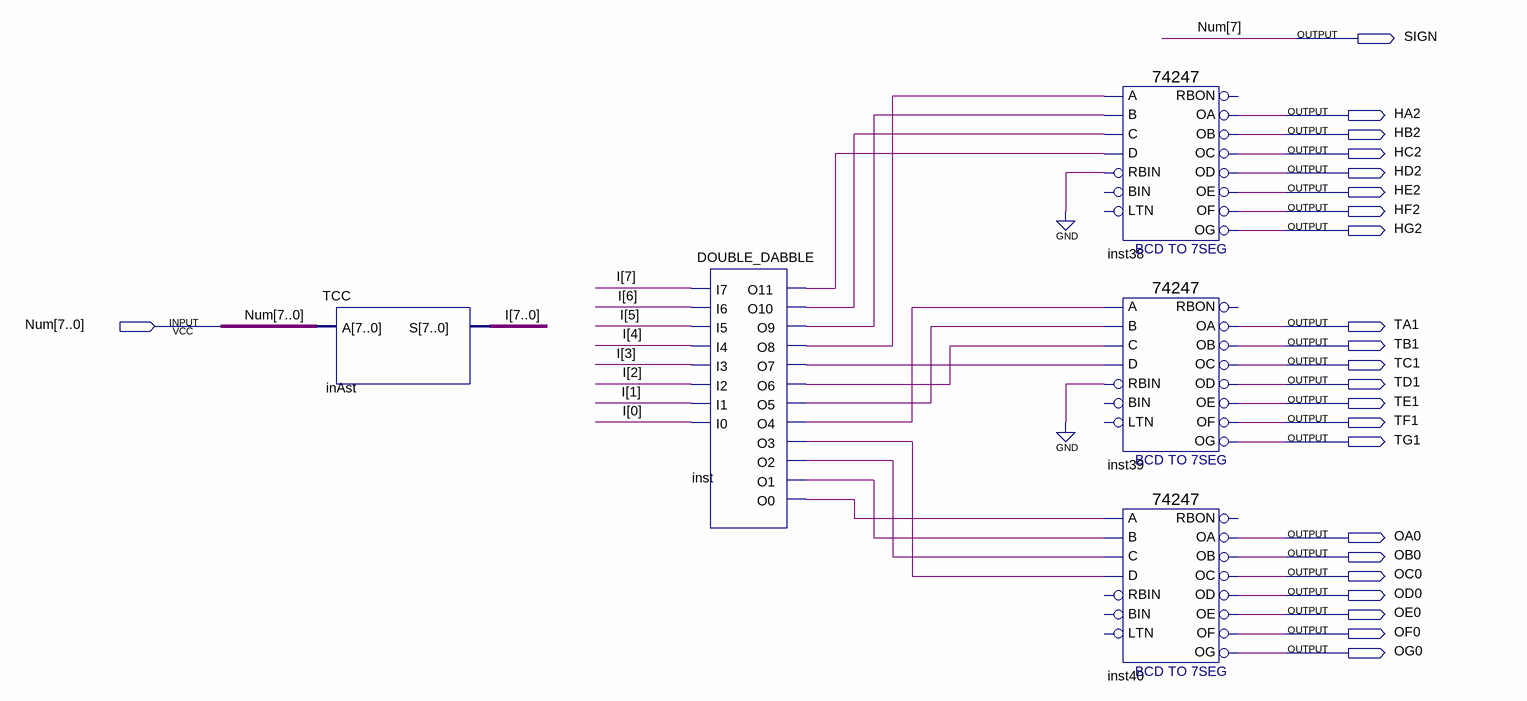
[diagram p0: schematic sheet]
// Quartus schematic Display_Led_7_Segments.bdf as structural Verilog: 5 symbols, 23 pins
module Display_Led_7_Segments (
  input  [7:0] Num,
  output SIGN,
  output HA2,
  output HB2,
  output HC2,
  output HD2,
  output HE2,
  output HF2,
  output HG2,
  output TA1,
  output TB1,
  output TC1,
  output TD1,
  output TE1,
  output TF1,
  output TG1,
  output OA0,
  output OB0,
  output OC0,
  output OD0,
  output OE0,
  output OF0,
  output OG0
);

  wire inst_o0, inst_o1, inst_o2, inst_o3, inst_o4, inst_o5, inst_o6, inst_o7, inst_o8, inst_o9, inst_o10,
       inst_o11;
  wire [7:0] I;

  TCC inAst (.A(Num), .S(I));
  DOUBLE_DABBLE inst (
    .I7(I[7]), .I6(I[6]), .I5(I[5]), .I4(I[4]), .I3(I[3]), .I2(I[2]), .I1(I[1]), .I0(I[0]), .O11(inst_o11),
    .O10(inst_o10), .O9(inst_o9), .O8(inst_o8), .O7(inst_o7), .O6(inst_o6), .O5(inst_o5), .O4(inst_o4),
    .O3(inst_o3), .O2(inst_o2), .O1(inst_o1), .O0(inst_o0));
  \74247  inst38 (
    .A(inst_o8), .B(inst_o9), .RBIN(1'b0), .C(inst_o10), .D(inst_o11), .OF(HF2), .OC(HC2), .OD(HD2),
    .OE(HE2), .OA(HA2), .OB(HB2), .OG(HG2));  // open: LTN, BIN, RBON
  \74247  inst39 (
    .A(inst_o4), .B(inst_o5), .RBIN(1'b0), .C(inst_o6), .D(inst_o7), .OF(TF1), .OC(TC1), .OD(TD1), .OE(TE1),
    .OA(TA1), .OB(TB1), .OG(TG1));  // open: LTN, BIN, RBON
  \74247  inst40 (
    .A(inst_o0), .B(inst_o1), .C(inst_o2), .D(inst_o3), .OF(OF0), .OC(OC0), .OD(OD0), .OE(OE0), .OA(OA0),
    .OB(OB0), .OG(OG0));  // open: LTN, BIN, RBIN, RBON

  assign SIGN = Num[7];
endmodule
